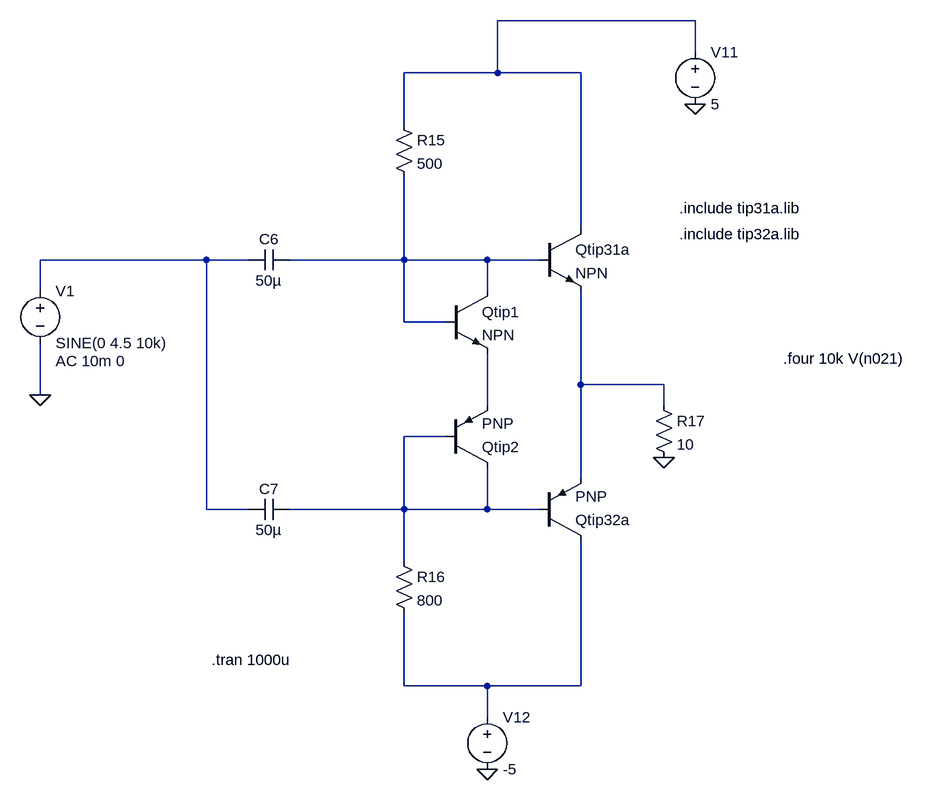
[diagram p0: schematic Power_amplifier.asc]
Power_amplifier.asc, the LTspice schematic file:
Version 4.1
SHEET 1 5036 884
WIRE 3296 -288 2992 -288
WIRE 3296 -240 3296 -288
WIRE 2992 -208 2992 -288
WIRE 2992 -208 2848 -208
WIRE 3120 -208 2992 -208
WIRE 2848 -128 2848 -208
WIRE 3120 32 3120 -208
WIRE 2544 80 2288 80
WIRE 2608 80 2544 80
WIRE 2848 80 2848 -48
WIRE 2848 80 2672 80
WIRE 2976 80 2848 80
WIRE 3056 80 2976 80
WIRE 2288 128 2288 80
WIRE 2976 128 2976 80
WIRE 2848 176 2848 80
WIRE 2912 176 2848 176
WIRE 3120 272 3120 128
WIRE 3248 272 3120 272
WIRE 2288 288 2288 208
WIRE 2976 304 2976 224
WIRE 3248 304 3248 272
WIRE 2912 352 2848 352
WIRE 3120 416 3120 272
WIRE 2544 464 2544 80
WIRE 2608 464 2544 464
WIRE 2848 464 2848 352
WIRE 2848 464 2672 464
WIRE 2976 464 2976 400
WIRE 2976 464 2848 464
WIRE 3056 464 2976 464
WIRE 2848 544 2848 464
WIRE 2848 736 2848 624
WIRE 2976 736 2848 736
WIRE 3120 736 3120 512
WIRE 3120 736 2976 736
WIRE 2976 784 2976 736
FLAG 2288 288 0
FLAG 3248 384 0
FLAG 3296 -160 0
FLAG 2976 864 0
SYMBOL voltage 2288 112 R0
WINDOW 123 24 124 Left 2
WINDOW 39 0 0 Left 0
SYMATTR Value2 AC 10m 0
SYMATTR InstName V1
SYMATTR Value SINE(0 4.5 10k)
SYMBOL cap 2672 64 R90
WINDOW 0 0 32 VBottom 2
WINDOW 3 32 32 VTop 2
SYMATTR InstName C6
SYMATTR Value 50µ
SYMBOL cap 2672 448 R90
WINDOW 0 0 32 VBottom 2
WINDOW 3 32 32 VTop 2
SYMATTR InstName C7
SYMATTR Value 50µ
SYMBOL res 2832 -144 R0
SYMATTR InstName R15
SYMATTR Value 500
SYMBOL res 2832 528 R0
SYMATTR InstName R16
SYMATTR Value 800
SYMBOL npn 3056 32 R0
SYMATTR InstName Qtip31a
SYMBOL voltage 3296 -256 R0
WINDOW 123 0 0 Left 0
WINDOW 39 0 0 Left 0
SYMATTR InstName V11
SYMATTR Value 5
SYMBOL res 3232 288 R0
SYMATTR InstName R17
SYMATTR Value 10
SYMBOL pnp 3056 512 M180
SYMATTR InstName Qtip32a
SYMBOL voltage 2976 768 R0
WINDOW 123 0 0 Left 0
WINDOW 39 0 0 Left 0
SYMATTR InstName V12
SYMATTR Value -5
SYMBOL npn 2912 128 R0
SYMATTR InstName Qtip1
SYMBOL pnp 2912 400 M180
SYMATTR InstName Qtip2
TEXT 2552 696 Left 2 !.tran 1000u
TEXT 3272 0 Left 2 !.include tip31a.lib
TEXT 3272 40 Left 2 !.include tip32a.lib
TEXT 3432 232 Left 2 !.four 10k V(n021)

The netlist it stands for:
* Power_amplifier.asc
V1 N002 0 SINE(0 4.5 10k) AC 10m 0
C6 N003 N002 50µ
C7 N006 N002 50µ
R15 N001 N003 500
R16 N006 N007 800
Qtip31a N001 N003 N004 0 NPN
V11 N001 0 5
R17 N004 0 10
Qtip32a N007 N006 N004 0 PNP
V12 N007 0 -5
Qtip1 N003 N003 N005 0 NPN
Qtip2 N006 N006 N005 0 PNP
.model NPN NPN
.model PNP PNP
.lib standard.bjt
.tran 1000u
.include tip31a.lib
.include tip32a.lib
.four 10k V(n021)
.backanno
.end